# Altium schematic sheet 5_spi_memory.SchDoc: SPI memory (FM25V02A)
size A4; SheetNumber: 5; SheetTotal: 8
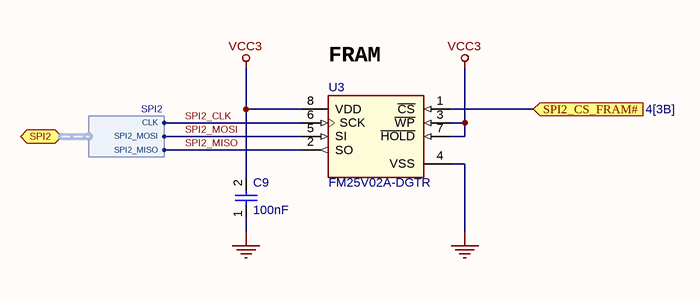
[diagram p0: 5_spi_memory.SchDoc]

## Parts
C9  value 100nF  [CAPC0402(1005)60_L]  (hidden comment: Capacitor 100nF +/-20% 10V 0402)
U3  FM25V02A-DGTR  [SON95P400X75_HS-9N]

## Ports
SPI2 (bidir, harness SPI2), SPI2_CS_FRAM# (in, see 4[3B])

## Harnesses
SPI2: SPI2_MISO, CLK, SPI2_MOSI

## Nets
GND: C9.1 U3.4(VSS)
VCC3: C9.2 U3.3(~{WP}) U3.7(~{HOLD}) U3.8(VDD)
SPI2_CLK: U3.6(SCK) ; port SPI2.CLK
SPI2_CS_FRAM#: U3.1(~{CS}) ; port SPI2_CS_FRAM#
SPI2_MISO: U3.2(SO) ; port SPI2.SPI2_MISO
SPI2_MOSI: U3.5(SI) ; port SPI2.SPI2_MOSI

## Notes on the sheet
- (near U3) FRAM
- Title
- Size:
- Date:
- A4
- Number:
- Time:
- Revision:
- Sheet
- of
- File:

## Library data of the parts
C9 = CMP-001-00061-2: Chip Capacitor, 100nF +/-20%, 10V, 0402, Thickness 0.6 mm; Tolerance: 20%; Case/Package: 0402; Min Operating Temperature: -55°C; Mounting Technology: SMT; Max Operating Temperature: 85°C; Pins: 2; Voltage Rating: 10V
U3 = CMP-019-00034-1: REEL / F-RAM Memory Serial; Memory Format: FRAM,RAM; Speed: 40MHz; Min Operating Temperature: -40°C; Pins: 8; Max Operating Temperature: 85°C; Case/Package: DFN